# EAGLE design garden (EAGLE 7.7.0)
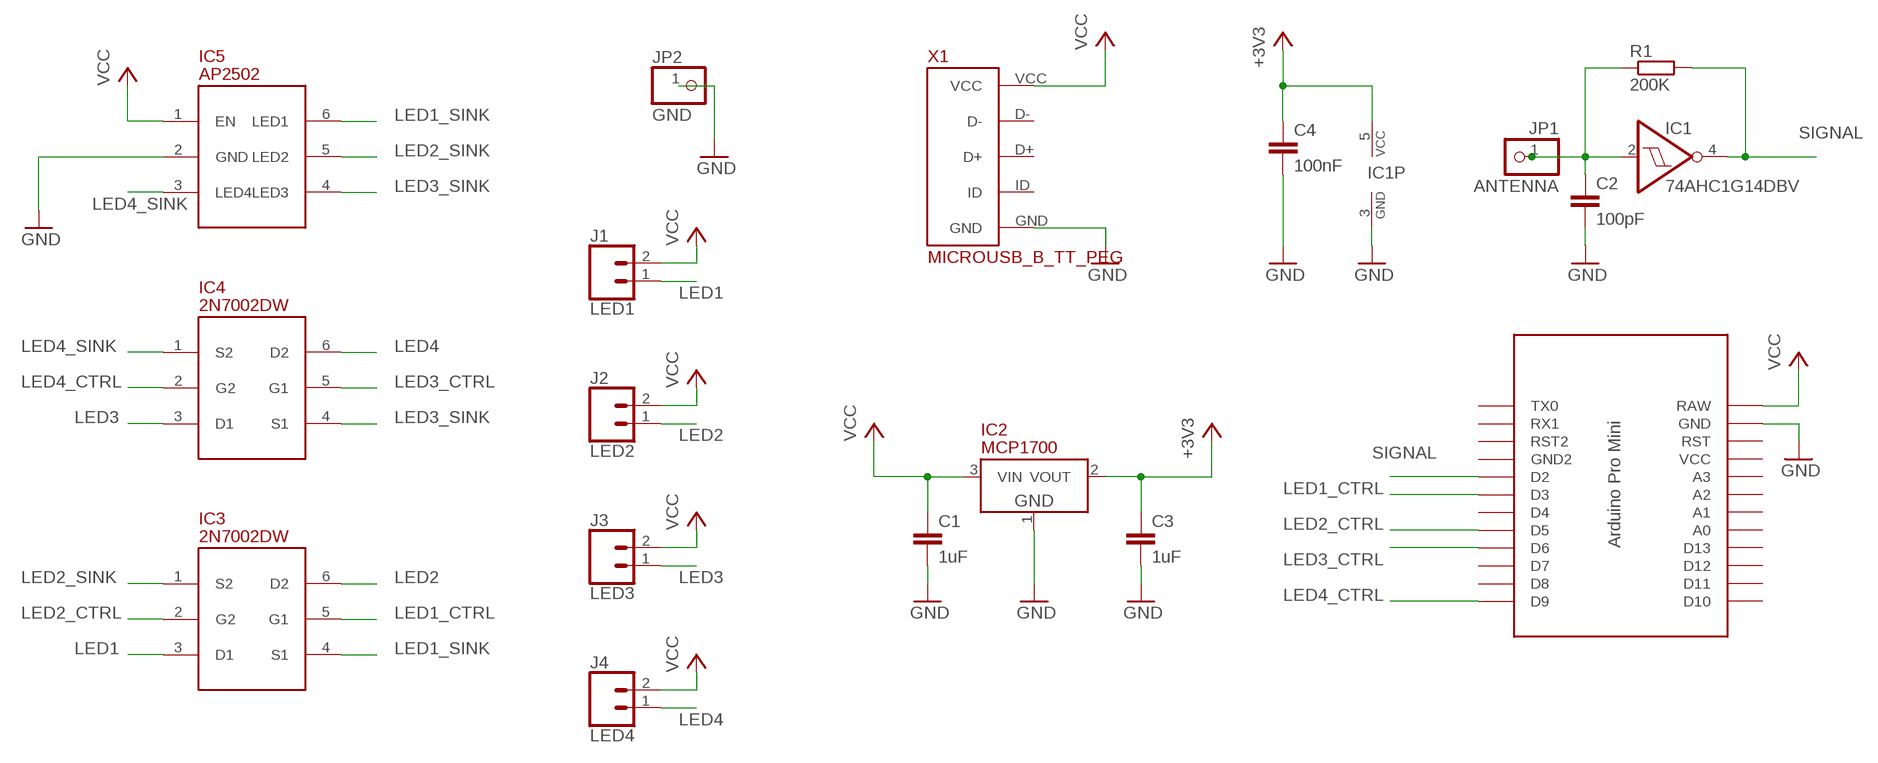
[diagram p0: schematic, sheet 1]

## Parts
C1  1uF  C-EUC0805  [C0805]
C2  100pF  C-EUC0805  [C0805]
C3  1uF  C-EUC0805  [C0805]
C4  100nF  C-EUC0805  [C0805]
IC1  74AHC1G14DBV  [SOT23-5]
IC2  MCP1700  [SOT-23]
IC3  2N7002DW  [SOT363]
IC4  2N7002DW  [SOT363]
IC5  AP2502  [SOT-23-6]
J1  LED1  CONN_02  [1X02]
J2  LED2  CONN_02  [1X02]
J3  LED3  CONN_02  [1X02]
J4  LED4  CONN_02  [1X02]
JP1  ANTENNA  PINHD-1X1  [1X01]
JP2  GND  PINHD-1X1  [1X01]
R1  200K  R-EU_R0805  [R0805]
U$1  PRO-MINI-TWO-SIDES-ONLY  [PRO-MINI-TWO-SIDES-ONLY]
X1  MICROUSB_B_TT_PEG  [MICROUSB_B_TT_PEG]

## Nets
+3V3 [vcc]: C3.1 C4.1 IC1.5(VCC) IC2.2(VOUT)
ANTENNA: C2.1 IC1.2(I) JP1.1 R1.1
GND: C1.2 C2.2 C3.2 C4.2 IC1.3(GND) IC2.1(GND) IC5.2(GND) JP2.1 U$1.GND X1.GND
LED1: IC3.3(D1) J1.1
LED1_CTRL: IC3.5(G1) U$1.D3
LED1_SINK: IC3.4(S1) IC5.6(LED1)
LED2: IC3.6(D2) J2.1
LED2_CTRL: IC3.2(G2) U$1.D5
LED2_SINK: IC3.1(S2) IC5.5(LED2)
LED3: IC4.3(D1) J3.1
LED3_CTRL: IC4.5(G1) U$1.D6
LED3_SINK: IC4.4(S1) IC5.4(LED3)
LED4: IC4.6(D2) J4.1
LED4_CTRL: IC4.2(G2) U$1.D9
LED4_SINK: IC4.1(S2) IC5.3(LED4)
SIGNAL: IC1.4(O) R1.2 U$1.D2
VCC [vcc]: C1.1 IC2.3(VIN) IC5.1(EN) J1.2 J2.2 J3.2 J4.2 U$1.RAW X1.VCC
Unconnected: U$1.A0 U$1.A1 U$1.A2 U$1.A3 U$1.D4 U$1.D7 U$1.D8 U$1.D10 U$1.D11 U$1.D12 U$1.D13 U$1.GND1(GND2) U$1.RST U$1.RST1(RST2) U$1.RX1 U$1.TX0 U$1.VCC X1.D+ X1.D- X1.ID

## Library data of the parts
C1-C4 = rcl:C-EU: CAPACITOR, European symbol
IC1 = 74xx-little-de:74*1G14: Single Schmitt-Trigger Inverter Gate
IC2 = laszlo_eagle:MCP1700: Low Quiescent Current LDO
IC3 IC4 = laszlo_eagle:2N7002DW: DUAL N-CHANNEL ENHANCEMENT MODE MOSFET
IC5 = laszlo_eagle:AP2502: 4-CH Linear Constant Current Sink With Matching
J1-J4 = SparkFun-Connectors:CONN_02: Multi connection point. Often used as Generic Header-pin footprint for 0.1 inch spaced/style header connections On any of the 0.1 inch spaced packages, you can populate with these: Break Away Headers - Straight <https://www.sparkfun.com/products/116> (PRT-00116) Break Away Male Headers - Right Angle <https://www.sparkfun.com/products/553> (PRT-00553) Female Headers <https://www.sparkfun.com/products/115> (PRT-00115) Break Away Headers - Machine Pin <https://www.sparkfun.com/products/117> (PRT-00117) Break Away Female Headers - Swiss Machine Pin <https://www.sparkfun.com/products/743> (PRT-00743) For SCREWTERMINALS and SPRING TERMINALS visit here: Screw Terimnals on SparkFun.com <https://www.sparkfun.com/search/results?term=Screw+Terminals> (5mm/3.5mm/2.54mm spacing) This device is also useful as a general connection point to wire up your design to another part of your project. Our various solder wires solder well into these plated through hole pads. Hook-Up Wire - Assortment (Stranded, 22 AWG) <https://www.sparkfun.com/products/11375> (PRT-11375) Hook-Up Wire - Assortment (Solid Core, 22 AWG) <https://www.sparkfun.com/products/11367> (PRT-11367) View the entire wire category on our website here <https://www.sparkfun.com/categories/141> Special notes: Molex polarized connector foot print use with: PRT-08233 with associated crimp pins and housings. 2.54_SCREWTERM for use with PRT-10571. 3.5mm Screw Terminal footprints for PRT-08084 5mm Screw Terminal footprints for use with PRT-08432
JP1 JP2 = pinhead:PINHD-1X1: PIN HEADER
R1 = resistor:R-EU_: RESISTOR, European symbol
U$1 = Arduino-clone:PRO-MINI-TWO-SIDES-ONLY
X1 = laszlo_eagle:MICROUSB_B_TT_PEG

## Net classes
0 default: width 0.203 mm
1 vcc: width 0.254 mm

## Board
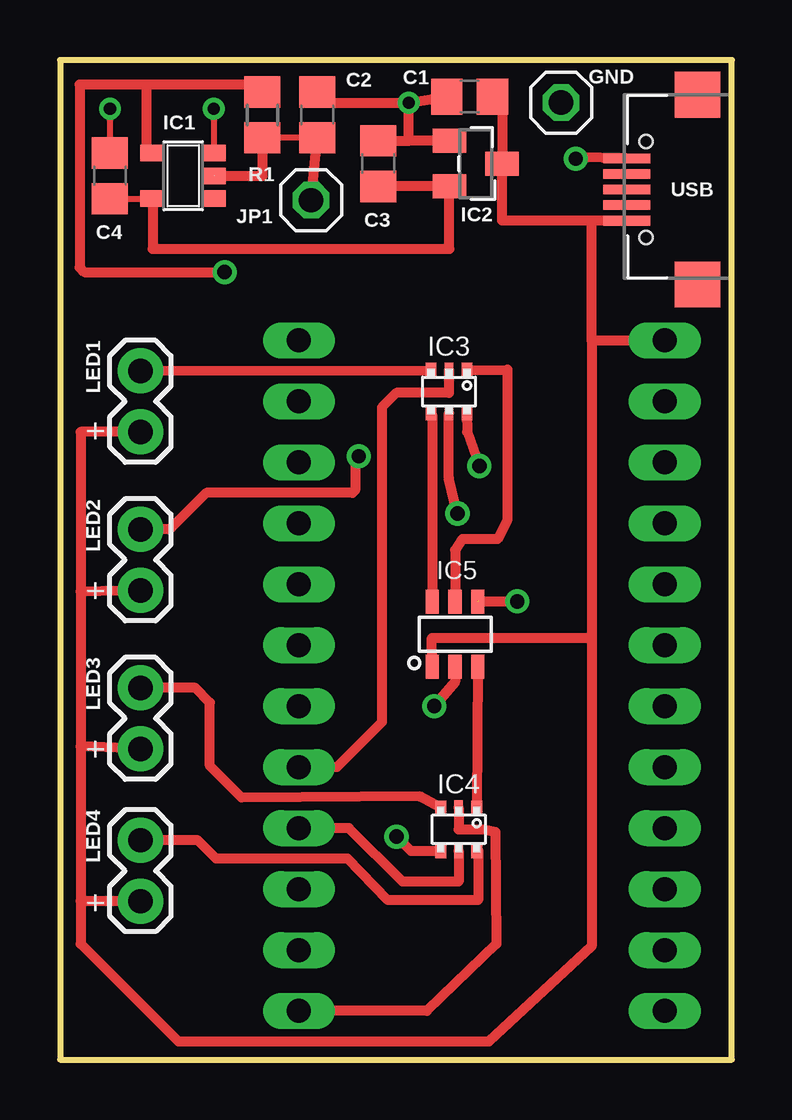
[diagram p1: board, top side]
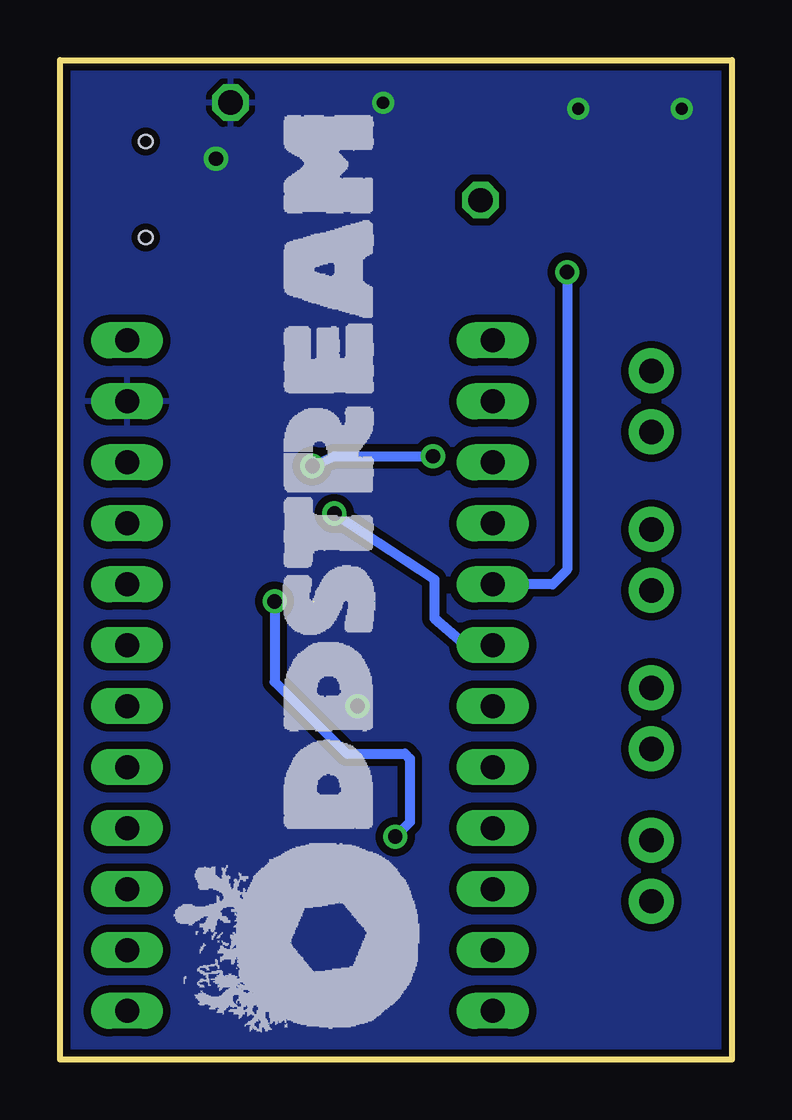
[diagram p2: board, bottom side, seen from below]

Size 27.99 x 41.66 mm. Coordinates in mm from the lower left corner, seen from the top.
Outline: 0,41.66 0,0 27.99,0 27.99,41.66 0,41.66
Copper layers (1*16): Top 0.035mm / dielectric 1.5mm / Bottom 0.035mm
Design rules "default *": minimum track width 10mil, minimum drill 20mil, track to track 8mil, track to pad 8mil, pad to pad 8mil, via to via 8mil, smd to smd 8mil, copper to edge 8mil, drill to drill 8mil, minimum pad ring 10mil, minimum via ring 8mil, stop-mask expansion 4mil, vias tented up to drill 0mil, thermal gap 10mil

### Footprints (pad centres in the part's own frame; a part is rotated, then mirrored left to right if it is on the bottom)
C0805 = smd 1.3 x 1.5: 1 -0.95,0; 2 0.95,0
SOT23-5 = smd 0.69 x 0.99: 1 -0.95,-1.29; 2 0,-1.29; 3 0.95,-1.29; 4 0.95,1.3; 5 -0.95,1.3
SOT-23 = smd 1 x 1.4: 1 -0.95,-1.1; 2 0.95,-1.1; 3 0,1.1
SOT363 = smd 0.6 x 0.5: 1 -0.9,0.75; 3 -0.9,-0.75; 4 0.9,-0.75; 6 0.9,0.75 | smd 0.6 x 0.4: 2 -0.9,0; 5 0.9,0
SOT-23-6 = smd 1 x 0.55: 1 -1.35,0.95; 2 -1.35,0; 3 -1.35,-0.95; 4 1.35,-0.95; 5 1.35,0; 6 1.35,0.95
1X02 = drill 1.016 pad 1.88: 1 0,0; 2 2.54,0
1X01 = drill 1.016 octagon: 1 0,0
R0805 = smd 1.3 x 1.5: 1 -0.95,0; 2 0.95,0
PRO-MINI-TWO-SIDES-ONLY = drill 1 long: A0 8.89,8.89; A1 8.89,11.43; A2 8.89,13.97; A3 8.89,16.51; D2 -6.35,16.51; D3 -6.35,13.97; D4 -6.35,11.43; D5 -6.35,8.89; D6 -6.35,6.35; D7 -6.35,3.81; D8 -6.35,1.27; D9 -6.35,-1.27; D10 8.89,-1.27; D11 8.89,1.27; D12 8.89,3.81; D13 8.89,6.35; GND 8.89,24.13; GND1 -6.35,19.05; RAW 8.89,26.67; RST 8.89,21.59; RST1 -6.35,21.59; RX1 -6.35,24.13; TX0 -6.35,26.67; VCC 8.89,19.05
MICROUSB_B_TT_PEG = smd 0.4 x 1.95: D+ -3.95,-2.95; D- -3.3,-2.95; GND -5.25,-2.95; ID -4.6,-2.95; VCC -2.65,-2.95 | smd 1.9 x 1.9: P$1 0,0; P$2 -7.9,0 | hole 0.55: -1.95,-2.15; -5.95,-2.15

### Placement (x,y rotation side)
C1  17.07,40.13 180 top
C2  10.72,39.37 90 top
C3  13.26,37.34 90 top
C4  2.08,36.83 90 top
IC1  5.13,36.83 90 top
IC2  17.32,37.34 270 top
IC3  16.21,27.84 270 top
IC4  16.61,9.6 270 top
IC5  16.46,17.73 90 top
J1  3.35,28.7 270 top
J2  3.35,22.1 270 top
J3  3.35,15.49 270 top
J4  3.35,9.14 270 top
JP1  10.46,35.81 0 top
JP2  20.88,39.88 0 top
R1  8.43,39.37 90 top
U$1  16.31,3.3 0 top
X1  26.57,32.31 270 top

### Tracks (layer width: path | path; a pad name or v marks a point on that pad's centre or on a via)
+3V3
  Top 0.254: 3.86,35.85 IC1.5 C4.1
  Top 0.406: C3.1 IC2.2 16.22,33.78 3.86,33.78 3.86,35.85
ANTENNA
  Top 0.254: C2.1 R1.1
  Top 0.406: R1.1 8.43,36.83 IC1.2 | 10.72,38.35 C2.1 JP1.1
GND  (via drill 0.51, 0.6)
  Top 0.254: v2.08,39.62 C4.2 | v6.4,39.62 6.4,37.8 IC1.3
  Top 0.406: 13.77,38.29 13.77,38.35 | 16.31,38.35 16.31,38.29 IC2.1 14.53,38.29 | 13,38.35 13,38.29 C3.2 13.77,38.29 | 13.77,38.29 14.53,38.29 | 14.53,38.29 v14.53,39.88 | v14.53,39.88 C1.2 | C2.2 10.72,39.88 v14.53,39.88 | X1.GND 21.49,37.61 v21.49,37.54 | IC5.2 16.46,15.75 v15.6,14.73
  pour Bottom (isolate 0.305): 0,41.66 0,0 27.99,0 27.99,41.66
LED1
  Top 0.406: J1.1 IC3.3
LED1_CTRL  (via drill 0.6)
  Top 0.406: v16.56,22.76 16.2,24.23 IC3.5
  Bottom 0.406: v16.56,22.76 12.39,20.02 12.39,18.39 11.07,17.27 U$1.D3
LED1_SINK
  Top 0.406: IC3.4 15.51,26.88 IC5.6
LED2  (via drill 0.6)
  Top 0.406: IC3.6 16.97,26.16 v17.47,24.74 | v12.45,25.15 12.29,24.84 12.29,23.72 12.19,23.62 6.1,23.62 4.57,22.1 J2.1
  Bottom 0.406: v17.47,24.74 16.56,25.15 v12.45,25.15
LED2_CTRL
  Top 0.406: IC3.2 16.2,27.79 14.02,27.79 13.41,27.18 13.41,14.07 11.53,12.19 U$1.D5
LED2_SINK
  Top 0.406: IC3.1 18.64,28.75 18.64,22.5 18.24,21.69 16.76,21.69 16.46,21.23 IC5.5
LED3
  Top 0.406: IC4.3 14.98,10.97 7.57,10.92 6.25,12.24 6.25,14.88 5.64,15.49 J3.1
LED3_CTRL
  Top 0.406: IC4.5 16.61,7.42 14.27,7.42 12.04,9.65 U$1.D6
LED3_SINK  (via drill 0.6)  (1 unrouted)
  Top 0.406: 17.43,19.1 v19.05,19.1 | v14.02,9.3 14.62,8.7 IC4.4
  Bottom 0.406: v19.05,19.1 19.05,15.75 16.05,12.75 13.61,12.75 13.41,12.55 13.41,9.91 v14.02,9.3
LED4
  Top 0.406: IC4.6 17.42,8.74 17.42,6.65 13.66,6.65 11.99,8.38 6.5,8.38 5.74,9.14 J4.1
LED4_CTRL
  Top 0.406: IC4.2 16.61,9.6 17.68,9.6 18.14,9.5 18.19,4.83 15.29,2.03 U$1.D9
LED4_SINK
  Top 0.406: IC5.3 IC4.1
SIGNAL  (via drill 0.6)
  Top 0.254: 3.86,37.81 IC1.4
  Top 0.406: 3.61,40.64 0.81,40.64 0.81,33.02 1.02,32.82 v6.86,32.82 | 3.61,40.64 8.18,40.64 R1.2 | 3.86,37.81 3.61,37.81 3.61,40.64
  Bottom 0.406: v6.86,32.82 6.86,20.42 7.47,19.81 U$1.D2
VCC
  Top 0.406: 22.15,29.97 U$1.RAW | C1.1 18.42,40.13 IC2.3 18.42,34.96 22.15,34.96 | X1.VCC 22.15,34.96 | 22.15,29.97 22.15,34.96 | 3.42,6.86 J4.2 0.86,6.6 | 22.15,29.97 22.15,17.58 | 22.15,17.58 22.15,4.72 17.88,0.76 4.93,0.76 0.86,4.83 0.86,6.6 | J1.2 0.86,26.16 0.86,19.51 | 0.86,19.51 0.86,13.06 | 0.86,13.06 0.86,6.6 | J2.2 0.86,19.51 | J3.2 0.86,13.06 | IC5.1 15.49,17.58 22.15,17.58

### Text on the board
tNames: USB | + | + | + | +